# Altium project 7-SegmentLED_v2.PrjPcb
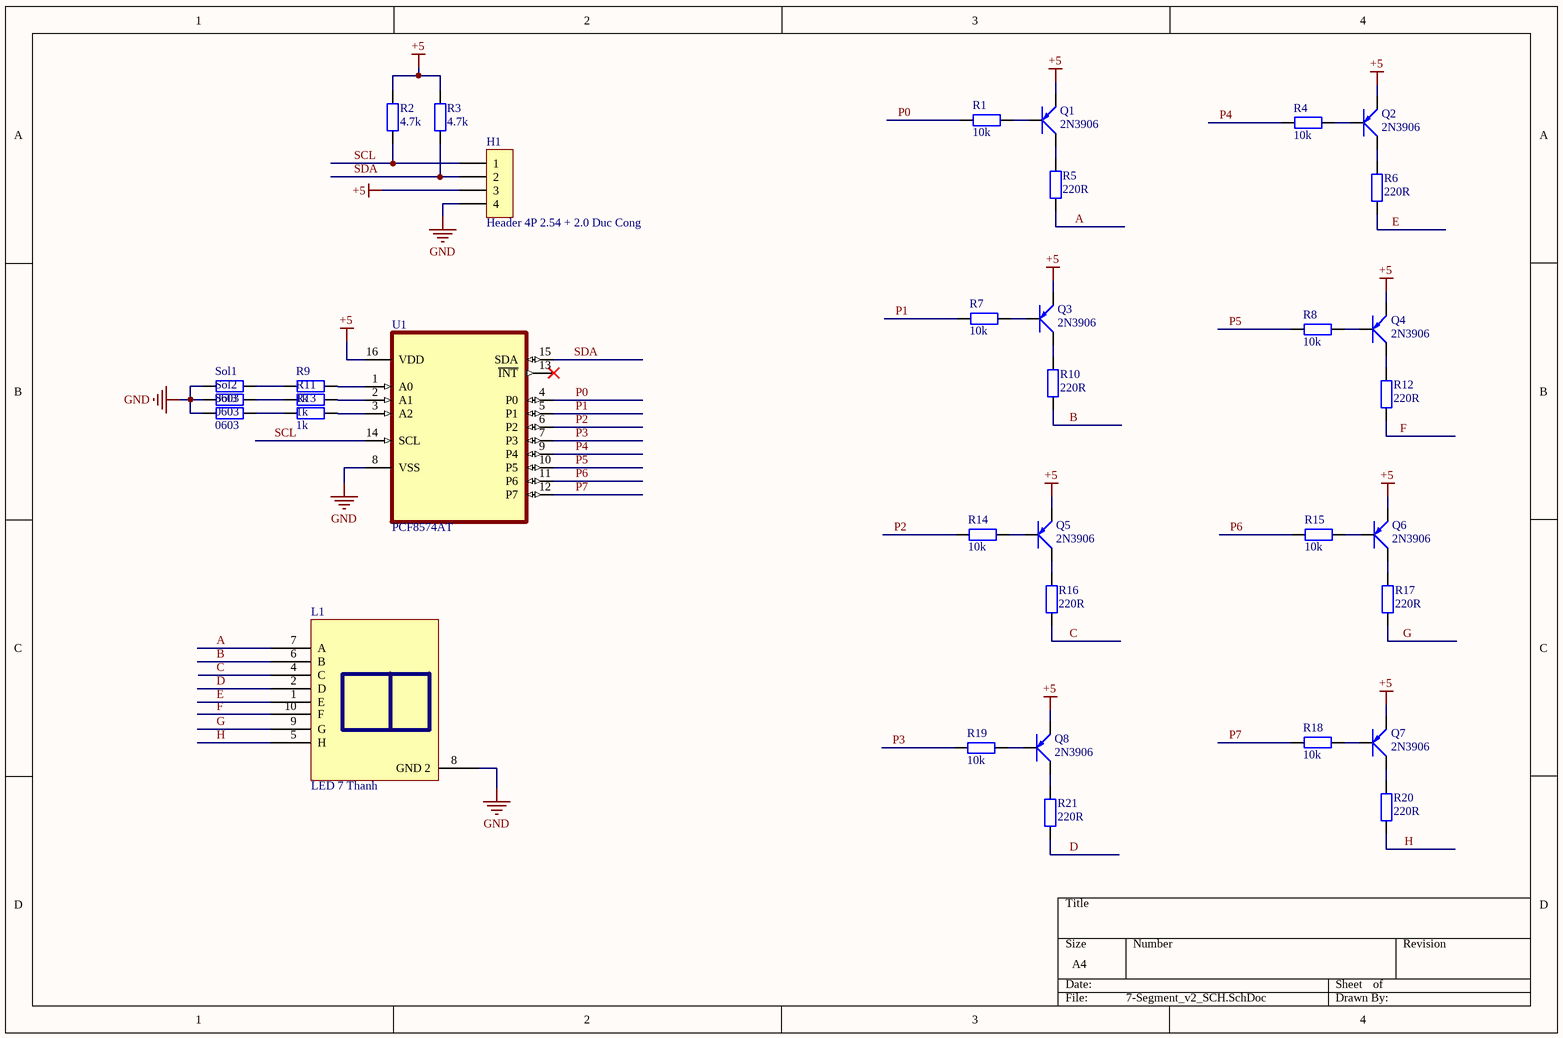
[diagram p0: 7-Segment_v2_SCH.SchDoc]
1 sheet, 35 parts. Net scope: global (net labels, ports and power ports of the same name join across sheets).
Board file: 7-Segment_v2_PCB.PcbDoc

## Sheet 7-Segment_v2_SCH.SchDoc
size A4; SheetNumber: 1; SheetTotal: 1

### Parts
H1  Header 4P 2.54 + 2.0 Duc Cong  [Header 4P DC 2.54 + 2.0]
L1  LED 7 Thanh  [LED 7x1 0.28]
Q1  2N3906  [SOT23]
Q2  2N3906  [SOT23]
Q3  2N3906  [SOT23]
Q4  2N3906  [SOT23]
Q5  2N3906  [SOT23]
Q6  2N3906  [SOT23]
Q7  2N3906  [SOT23]
Q8  2N3906  [SOT23]
R1  10k  [tro smd 0603]
R2  4.7k  [tro smd 0603]
R3  4.7k  [tro smd 0603]
R4  10k  [tro smd 0603]
R5  220R  [tro smd 0603]
R6  220R  [tro smd 0603]
R7  10k  [tro smd 0603]
R8  10k  [tro smd 0603]
R9  1k  [tro smd 0603]
R10  220R  [tro smd 0603]
R11  1k  [tro smd 0603]
R12  220R  [tro smd 0603]
R13  1k  [tro smd 0603]
R14  10k  [tro smd 0603]
R15  10k  [tro smd 0603]
R16  220R  [tro smd 0603]
R17  220R  [tro smd 0603]
R18  10k  [tro smd 0603]
R19  10k  [tro smd 0603]
R20  220R  [tro smd 0603]
R21  220R  [tro smd 0603]
Sol1  0603  [Solder 0603]
Sol2  0603  [Solder 0603]
Sol3  0603  [Solder 0603]
U1  PCF8574AT  [SOIC127P1032X265-16N]

### Nets
+5: H1.3 Q1.2(E) Q2.2(E) Q3.2(E) Q4.2(E) Q5.2(E) Q6.2(E) Q7.2(E) Q8.2(E) R2.2 R3.2 U1.16(VDD)
GND: H1.4 L1.8(GND_2) Sol1.1 Sol2.1 Sol3.1 U1.8(VSS)
A: L1.7(A) R5.1
B: L1.6(B) R10.1
C: L1.4(C) R16.1
D: L1.2(D) R21.1
E: L1.1(E) R6.1
F: L1.10(F) R12.1
G: L1.9(G) R17.1
H: L1.5(H) R20.1
P0: R1.1 U1.4(P0)
P1: R7.1 U1.5(P1)
P2: R14.1 U1.6(P2)
P3: R19.1 U1.7(P3)
P4: R4.1 U1.9(P4)
P5: R8.1 U1.10(P5)
P6: R15.1 U1.11(P6)
P7: R18.1 U1.12(P7)
SCL: H1.1 R2.1 U1.14(SCL)
SDA: H1.2 R3.1 U1.15(SDA)
NetQ1_1: Q1.1(B) R1.2
NetQ1_3: Q1.3(C) R5.2
NetQ2_1: Q2.1(B) R4.2
NetQ2_3: Q2.3(C) R6.2
NetQ3_1: Q3.1(B) R7.2
NetQ3_3: Q3.3(C) R10.2
NetQ4_1: Q4.1(B) R8.2
NetQ4_3: Q4.3(C) R12.2
NetQ5_1: Q5.1(B) R14.2
NetQ5_3: Q5.3(C) R16.2
NetQ6_1: Q6.1(B) R15.2
NetQ6_3: Q6.3(C) R17.2
NetQ7_1: Q7.1(B) R18.2
NetQ7_3: Q7.3(C) R20.2
NetQ8_1: Q8.1(B) R19.2
NetQ8_3: Q8.3(C) R21.2
NetR9_1: R9.1 Sol1.2
NetR9_2: R9.2 U1.1(A0)
NetR11_1: R11.1 Sol2.2
NetR11_2: R11.2 U1.2(A1)
NetR13_1: R13.1 Sol3.2
NetR13_2: R13.2 U1.3(A2)

Not connected (* = marked no-connect by the designer): U1 13(~{INT})*

### Library data of the parts
H1 = Header 4P 2.54 + 2.0 Duc Cong: Cắm; Ten_Linh_Kien: Header 4P XH2.54-4P Đực Cong; Don_Vi: Con; Ma_Hang: MH001310; Chung_Loai: Cắm
L1 = LED 7x1 0.28 Katot: Dán; Don_Vi: Con; Ma_Hang: MH009707; Ten_Linh_Kien: Led 7 0.28 1 Số Katot Sáng Đỏ; Ghi_Chu: *; Kieu_Chan: *; Chung_Loai: Dán
Q1-Q8 = Trans A1015 BA SMD: PNP 600mW, ECB
R1-R4 R7 R8 R14 R15 R18 R19 = Tro 0603 1% 10k: Dán; Don_Vi: Con; So_Chan: 2; Ten_Linh_Kien: Trở 0603 1% 10k; Ma_Hang: MH006333; Chung_Loai: Dán; Kieu_Chan: *
R5 R6 R10 R12 R16 R17 R20 R21 = Tro 0603 5% 220R: Dán; Don_Vi: Con; So_Chan: 2; Ten_Linh_Kien: Trở 0603 5% 220R; Ma_Hang: MH006322; Chung_Loai: Dán; Kieu_Chan: *
R9 R11 R13 = Tro 0603 1% 1k: Dán; So_Chan: 2; Don_Vi: Con; Ten_Linh_Kien: Trở 0603 1% 1k; Ma_Hang: MH006334; Chung_Loai: Dán; Kieu_Chan: *
Sol1-Sol3 = Solder 0603: Dán; So_Chan: 2; Don_Vi: Con; Ten_Linh_Kien: Chân hàn 0603; Chung_Loai: Dán; Kieu_Chan: *
U1 = PCF8574AT: IÂ²C Bus IC Operating temperature: -40...+85 Â°C Power supply: 2.5...6 V Package: SO-16W; MF: NXP USA; SnapEDA_Link: https://www.snapeda.com/parts/PCF8574AT/NXP+Semiconductors/view-part/?ref=snap; Package: SOIC-16 NXP Semiconductors; Value: *; MP: PCF8574AT; Check_prices: https://www.snapeda.com/parts/PCF8574AT/NXP+Semiconductors/view-part/?ref=eda